# Altium schematic sheet KeyMatrix.SchDoc
size A4; SheetNumber: 1; SheetTotal: 2
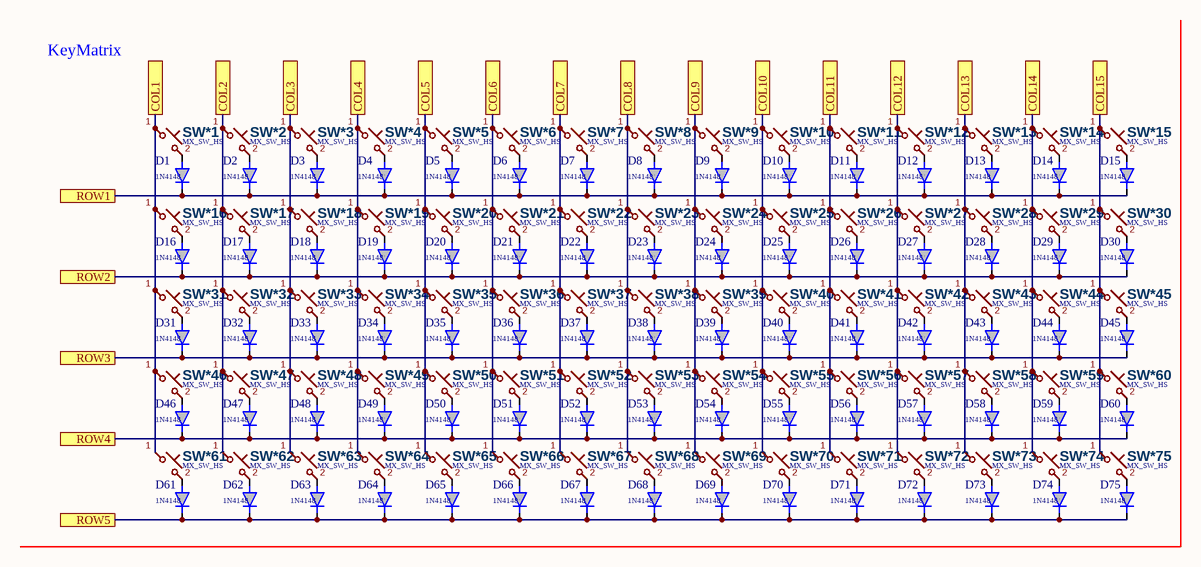
[diagram p0: KeyMatrix.SchDoc]

## Parts
D1  1N4148  [SOD3716X135N]
D2  1N4148  [SOD3716X135N]
D3  1N4148  [SOD3716X135N]
D4  1N4148  [SOD3716X135N]
D5  1N4148  [SOD3716X135N]
D6  1N4148  [SOD3716X135N]
D7  1N4148  [SOD3716X135N]
D8  1N4148  [SOD3716X135N]
D9  1N4148  [SOD3716X135N]
D10  1N4148  [SOD3716X135N]
D11  1N4148  [SOD3716X135N]
D12  1N4148  [SOD3716X135N]
D13  1N4148  [SOD3716X135N]
D14  1N4148  [SOD3716X135N]
D15  1N4148  [SOD3716X135N]
D16  1N4148  [SOD3716X135N]
D17  1N4148  [SOD3716X135N]
D18  1N4148  [SOD3716X135N]
D19  1N4148  [SOD3716X135N]
D20  1N4148  [SOD3716X135N]
D21  1N4148  [SOD3716X135N]
D22  1N4148  [SOD3716X135N]
D23  1N4148  [SOD3716X135N]
D24  1N4148  [SOD3716X135N]
D25  1N4148  [SOD3716X135N]
D26  1N4148  [SOD3716X135N]
D27  1N4148  [SOD3716X135N]
D28  1N4148  [SOD3716X135N]
D29  1N4148  [SOD3716X135N]
D30  1N4148  [SOD3716X135N]
D31  1N4148  [SOD3716X135N]
D32  1N4148  [SOD3716X135N]
D33  1N4148  [SOD3716X135N]
D34  1N4148  [SOD3716X135N]
D35  1N4148  [SOD3716X135N]
D36  1N4148  [SOD3716X135N]
D37  1N4148  [SOD3716X135N]
D38  1N4148  [SOD3716X135N]
D39  1N4148  [SOD3716X135N]
D40  1N4148  [SOD3716X135N]
D41  1N4148  [SOD3716X135N]
D42  1N4148  [SOD3716X135N]
D43  1N4148  [SOD3716X135N]
D44  1N4148  [SOD3716X135N]
D45  1N4148  [SOD3716X135N]
D46  1N4148  [SOD3716X135N]
D47  1N4148  [SOD3716X135N]
D48  1N4148  [SOD3716X135N]
D49  1N4148  [SOD3716X135N]
D50  1N4148  [SOD3716X135N]
D51  1N4148  [SOD3716X135N]
D52  1N4148  [SOD3716X135N]
D53  1N4148  [SOD3716X135N]
D54  1N4148  [SOD3716X135N]
D55  1N4148  [SOD3716X135N]
D56  1N4148  [SOD3716X135N]
D57  1N4148  [SOD3716X135N]
D58  1N4148  [SOD3716X135N]
D59  1N4148  [SOD3716X135N]
D60  1N4148  [SOD3716X135N]
D61  1N4148  [SOD3716X135N]
D62  1N4148  [SOD3716X135N]
D63  1N4148  [SOD3716X135N]
D64  1N4148  [SOD3716X135N]
D65  1N4148  [SOD3716X135N]
D66  1N4148  [SOD3716X135N]
D67  1N4148  [SOD3716X135N]
D68  1N4148  [SOD3716X135N]
D69  1N4148  [SOD3716X135N]
D70  1N4148  [SOD3716X135N]
D71  1N4148  [SOD3716X135N]
D72  1N4148  [SOD3716X135N]
D73  1N4148  [SOD3716X135N]
D74  1N4148  [SOD3716X135N]
D75  1N4148  [SOD3716X135N]
SW*1  MX_SW_HS
SW*2  MX_SW_HS
SW*3  MX_SW_HS
SW*4  MX_SW_HS
SW*5  MX_SW_HS
SW*6  MX_SW_HS
SW*7  MX_SW_HS
SW*8  MX_SW_HS
SW*9  MX_SW_HS
SW*10  MX_SW_HS
SW*11  MX_SW_HS
SW*12  MX_SW_HS
SW*13  MX_SW_HS
SW*14  MX_SW_HS
SW*15  MX_SW_HS
SW*16  MX_SW_HS
SW*17  MX_SW_HS
SW*18  MX_SW_HS
SW*19  MX_SW_HS
SW*20  MX_SW_HS
SW*21  MX_SW_HS
SW*22  MX_SW_HS
SW*23  MX_SW_HS
SW*24  MX_SW_HS
SW*25  MX_SW_HS
SW*26  MX_SW_HS
SW*27  MX_SW_HS
SW*28  MX_SW_HS
SW*29  MX_SW_HS
SW*30  MX_SW_HS
SW*31  MX_SW_HS
SW*32  MX_SW_HS
SW*33  MX_SW_HS
SW*34  MX_SW_HS
SW*35  MX_SW_HS
SW*36  MX_SW_HS
SW*37  MX_SW_HS
SW*38  MX_SW_HS
SW*39  MX_SW_HS
SW*40  MX_SW_HS
SW*41  MX_SW_HS
SW*42  MX_SW_HS
SW*43  MX_SW_HS
SW*44  MX_SW_HS
SW*45  MX_SW_HS
SW*46  MX_SW_HS
SW*47  MX_SW_HS
SW*48  MX_SW_HS
SW*49  MX_SW_HS
SW*50  MX_SW_HS
SW*51  MX_SW_HS
SW*52  MX_SW_HS
SW*53  MX_SW_HS
SW*54  MX_SW_HS
SW*55  MX_SW_HS
SW*56  MX_SW_HS
SW*57  MX_SW_HS
SW*58  MX_SW_HS
SW*59  MX_SW_HS
SW*60  MX_SW_HS
SW*61  MX_SW_HS
SW*62  MX_SW_HS
SW*63  MX_SW_HS
SW*64  MX_SW_HS
SW*65  MX_SW_HS
SW*66  MX_SW_HS
SW*67  MX_SW_HS
SW*68  MX_SW_HS
SW*69  MX_SW_HS
SW*70  MX_SW_HS
SW*71  MX_SW_HS
SW*72  MX_SW_HS
SW*73  MX_SW_HS
SW*74  MX_SW_HS
SW*75  MX_SW_HS

## Ports
COL1, COL2, COL3, COL4, COL5, COL6, COL7, COL8, COL9, COL10, COL11, COL12, COL13, COL14, COL15, ROW1, ROW2, ROW3, ROW4, ROW5

## Nets
COL1: SW*1.1 SW*16.1 SW*31.1 SW*46.1 SW*61.1 ; port COL1
COL2: SW*2.1 SW*17.1 SW*32.1 SW*47.1 SW*62.1 ; port COL2
COL3: SW*3.1 SW*18.1 SW*33.1 SW*48.1 SW*63.1 ; port COL3
COL4: SW*4.1 SW*19.1 SW*34.1 SW*49.1 SW*64.1 ; port COL4
COL5: SW*5.1 SW*20.1 SW*35.1 SW*50.1 SW*65.1 ; port COL5
COL6: SW*6.1 SW*21.1 SW*36.1 SW*51.1 SW*66.1 ; port COL6
COL7: SW*7.1 SW*22.1 SW*37.1 SW*52.1 SW*67.1 ; port COL7
COL8: SW*8.1 SW*23.1 SW*38.1 SW*53.1 SW*68.1 ; port COL8
COL9: SW*9.1 SW*24.1 SW*39.1 SW*54.1 SW*69.1 ; port COL9
COL10: SW*10.1 SW*25.1 SW*40.1 SW*55.1 SW*70.1 ; port COL10
COL11: SW*11.1 SW*26.1 SW*41.1 SW*56.1 SW*71.1 ; port COL11
COL12: SW*12.1 SW*27.1 SW*42.1 SW*57.1 SW*72.1 ; port COL12
COL13: SW*13.1 SW*28.1 SW*43.1 SW*58.1 SW*73.1 ; port COL13
COL14: SW*14.1 SW*29.1 SW*44.1 SW*59.1 SW*74.1 ; port COL14
COL15: SW*15.1 SW*30.1 SW*45.1 SW*60.1 SW*75.1 ; port COL15
ROW1: D1.1(A) D2.1(A) D3.1(A) D4.1(A) D5.1(A) D6.1(A) D7.1(A) D8.1(A) D9.1(A) D10.1(A) D11.1(A) D12.1(A) D13.1(A) D14.1(A) D15.1(A) ; port ROW1
ROW2: D16.1(A) D17.1(A) D18.1(A) D19.1(A) D20.1(A) D21.1(A) D22.1(A) D23.1(A) D24.1(A) D25.1(A) D26.1(A) D27.1(A) D28.1(A) D29.1(A) D30.1(A) ; port ROW2
ROW3: D31.1(A) D32.1(A) D33.1(A) D34.1(A) D35.1(A) D36.1(A) D37.1(A) D38.1(A) D39.1(A) D40.1(A) D41.1(A) D42.1(A) D43.1(A) D44.1(A) D45.1(A) ; port ROW3
ROW4: D46.1(A) D47.1(A) D48.1(A) D49.1(A) D50.1(A) D51.1(A) D52.1(A) D53.1(A) D54.1(A) D55.1(A) D56.1(A) D57.1(A) D58.1(A) D59.1(A) D60.1(A) ; port ROW4
ROW5: D61.1(A) D62.1(A) D63.1(A) D64.1(A) D65.1(A) D66.1(A) D67.1(A) D68.1(A) D69.1(A) D70.1(A) D71.1(A) D72.1(A) D73.1(A) D74.1(A) D75.1(A) ; port ROW5
NetD1_2: D1.2(A) SW*1.2
NetD2_2: D2.2(A) SW*2.2
NetD3_2: D3.2(A) SW*3.2
NetD4_2: D4.2(A) SW*4.2
NetD5_2: D5.2(A) SW*5.2
NetD6_2: D6.2(A) SW*6.2
NetD7_2: D7.2(A) SW*7.2
NetD8_2: D8.2(A) SW*8.2
NetD9_2: D9.2(A) SW*9.2
NetD10_2: D10.2(A) SW*10.2
NetD11_2: D11.2(A) SW*11.2
NetD12_2: D12.2(A) SW*12.2
NetD13_2: D13.2(A) SW*13.2
NetD14_2: D14.2(A) SW*14.2
NetD15_2: D15.2(A) SW*15.2
NetD16_2: D16.2(A) SW*16.2
NetD17_2: D17.2(A) SW*17.2
NetD18_2: D18.2(A) SW*18.2
NetD19_2: D19.2(A) SW*19.2
NetD20_2: D20.2(A) SW*20.2
NetD21_2: D21.2(A) SW*21.2
NetD22_2: D22.2(A) SW*22.2
NetD23_2: D23.2(A) SW*23.2
NetD24_2: D24.2(A) SW*24.2
NetD25_2: D25.2(A) SW*25.2
NetD26_2: D26.2(A) SW*26.2
NetD27_2: D27.2(A) SW*27.2
NetD28_2: D28.2(A) SW*28.2
NetD29_2: D29.2(A) SW*29.2
NetD30_2: D30.2(A) SW*30.2
NetD31_2: D31.2(A) SW*31.2
NetD32_2: D32.2(A) SW*32.2
NetD33_2: D33.2(A) SW*33.2
NetD34_2: D34.2(A) SW*34.2
NetD35_2: D35.2(A) SW*35.2
NetD36_2: D36.2(A) SW*36.2
NetD37_2: D37.2(A) SW*37.2
NetD38_2: D38.2(A) SW*38.2
NetD39_2: D39.2(A) SW*39.2
NetD40_2: D40.2(A) SW*40.2
NetD41_2: D41.2(A) SW*41.2
NetD42_2: D42.2(A) SW*42.2
NetD43_2: D43.2(A) SW*43.2
NetD44_2: D44.2(A) SW*44.2
NetD45_2: D45.2(A) SW*45.2
NetD46_2: D46.2(A) SW*46.2
NetD47_2: D47.2(A) SW*47.2
NetD48_2: D48.2(A) SW*48.2
NetD49_2: D49.2(A) SW*49.2
NetD50_2: D50.2(A) SW*50.2
NetD51_2: D51.2(A) SW*51.2
NetD52_2: D52.2(A) SW*52.2
NetD53_2: D53.2(A) SW*53.2
NetD54_2: D54.2(A) SW*54.2
NetD55_2: D55.2(A) SW*55.2
NetD56_2: D56.2(A) SW*56.2
NetD57_2: D57.2(A) SW*57.2
NetD58_2: D58.2(A) SW*58.2
NetD59_2: D59.2(A) SW*59.2
NetD60_2: D60.2(A) SW*60.2
NetD61_2: D61.2(A) SW*61.2
NetD62_2: D62.2(A) SW*62.2
NetD63_2: D63.2(A) SW*63.2
NetD64_2: D64.2(A) SW*64.2
NetD65_2: D65.2(A) SW*65.2
NetD66_2: D66.2(A) SW*66.2
NetD67_2: D67.2(A) SW*67.2
NetD68_2: D68.2(A) SW*68.2
NetD69_2: D69.2(A) SW*69.2
NetD70_2: D70.2(A) SW*70.2
NetD71_2: D71.2(A) SW*71.2
NetD72_2: D72.2(A) SW*72.2
NetD73_2: D73.2(A) SW*73.2
NetD74_2: D74.2(A) SW*74.2
NetD75_2: D75.2(A) SW*75.2

## Notes on the sheet
- KeyMatrix

## Library data of the parts
D1-D75 = 1N4148_SOD-123_: Small Signal Fast Switching Diode; Manufacturer_Name: Vishay; Manufacturer_Part_Number: 1N4148(SOD-123); Geometry.Height: 1.35mm; Mouser Part Number: *; Mouser Price/Stock: *; Arrow Part Number: *; Arrow Price/Stock: *; Datasheet Link: https://docs.rs-online.com/d6a2/0900766b80df8fd1.pdf
SW*1-SW*75 = MX_SW_HS: ki_keywords: switch normally-open pushbutton push-button; ki_description: Push button switch, normally open, two pins, 45° tilted; Footprint: PCM_marbastlib-mx:SW_MX_HS_1u; Datasheet: ~